# Altium schematic sheet SPTSquidBoard.SchDoc
size A; DocumentNumber: 1; SheetNumber: 1; SheetTotal: 2
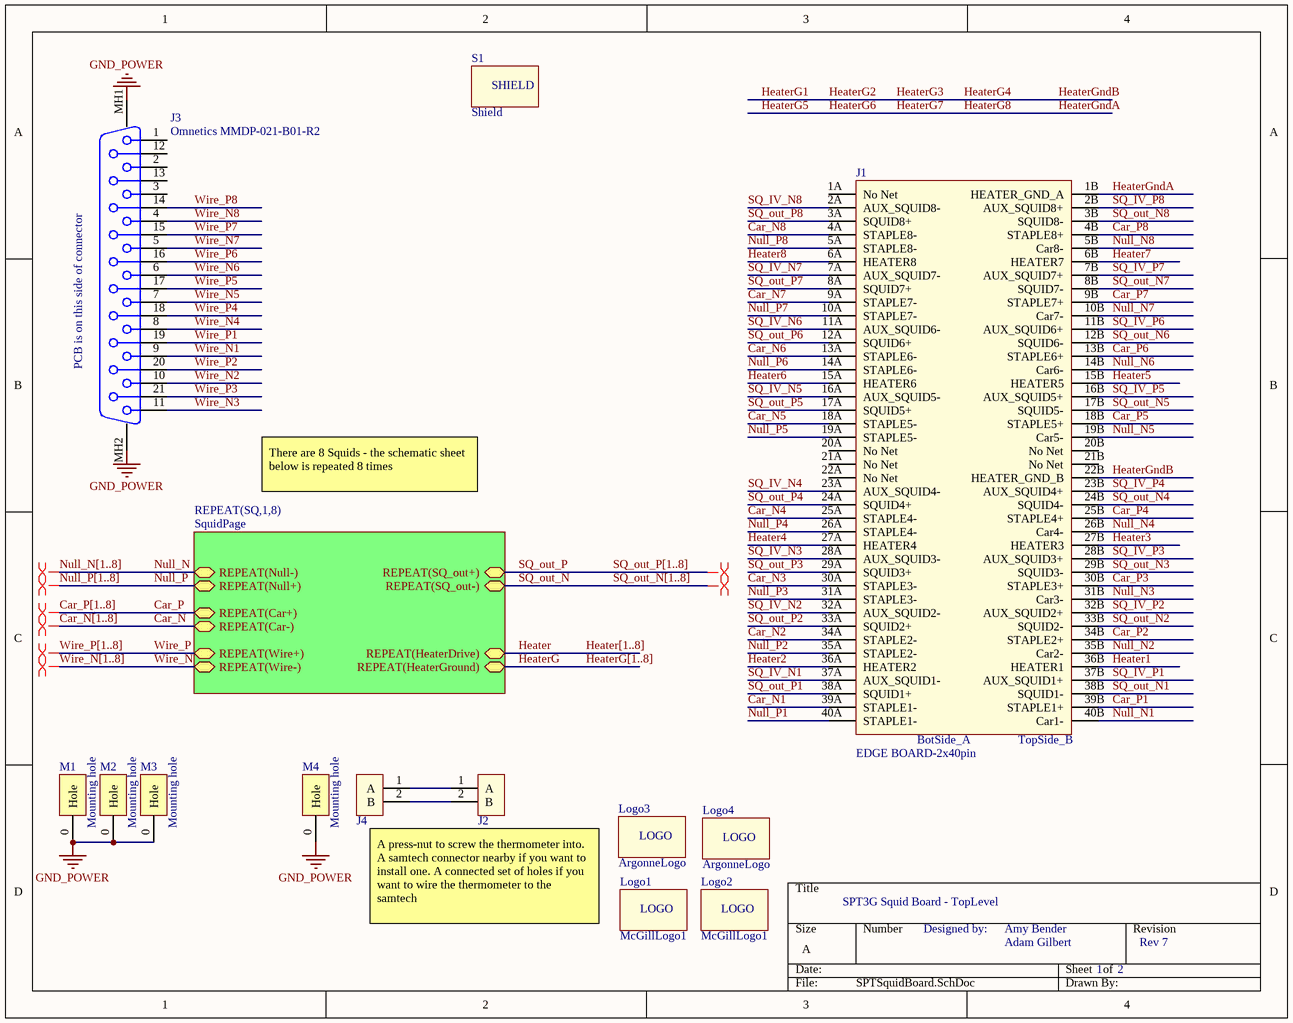
[diagram p0: SPTSquidBoard.SchDoc]

## Parts
J1  EDGE BOARD-2x40pin  (no BOM)
J2  TempSenseWireConnection  [TempSenseWireCons]  (value not drawn)  (no BOM)
J3  Omnetics MMDP-021-B01-R2  [MMDP-021-B02-R2]
J4  TempSenseWireConnection  [TempSenseWireCons]  (value not drawn)  (no BOM)
Logo1  McGillLogo1  [McGillLogo1]  (no BOM)
Logo2  McGillLogo1  [McGillLogo1]  (no BOM)
Logo3  ArgonneLogo  [ArgonneLogo]  (no BOM)
Logo4  ArgonneLogo  [ArgonneLogo]  (no BOM)
M1  Mounting hole  [MountingHoleSquidBoard]  (no BOM)
M2  Mounting hole  [MountingHoleSquidBoard]  (no BOM)
M3  Mounting hole  [MountingHoleSquidBoard]  (no BOM)
M4  Mounting hole  [MountingHoleSquidBoard]  (no BOM)
S1  Shield  [Shield]  (no BOM)

## Sub-sheets
REPEAT(SQ,1,8) = SquidPage: REPEAT(HeaterDrive), REPEAT(Null-), REPEAT(HeaterGround), REPEAT(Car+), REPEAT(Car-), REPEAT(SQ_out+), REPEAT(SQ_out-), REPEAT(Null+), REPEAT(Wire+), REPEAT(Wire-)

## Nets
GND_POWER: J3.MH1 J3.MH2 M1.0(Hole) M2.0(Hole) M3.0(Hole) M4.0(Hole)
Car_N: sheet REPEAT(SQ,1,8)/REPEAT(Car-)
Car_N1: J1.39A(STAPLE1-)
Car_N2: J1.34A(STAPLE2-)
Car_N3: J1.30A(STAPLE3-)
Car_N4: J1.25A(STAPLE4-)
Car_N5: J1.18A(STAPLE5-)
Car_N6: J1.13A(STAPLE6-)
Car_N7: J1.9A(STAPLE7-)
Car_N8: J1.4A(STAPLE8-)
Car_P: sheet REPEAT(SQ,1,8)/REPEAT(Car+)
Car_P1: J1.39B(STAPLE1+)
Car_P2: J1.34B(STAPLE2+)
Car_P3: J1.30B(STAPLE3+)
Car_P4: J1.25B(STAPLE4+)
Car_P5: J1.18B(STAPLE5+)
Car_P6: J1.13B(STAPLE6+)
Car_P7: J1.9B(STAPLE7+)
Car_P8: J1.4B(STAPLE8+)
Heater: sheet REPEAT(SQ,1,8)/REPEAT(HeaterDrive)
Heater1: J1.36B(HEATER1)
Heater2: J1.36A(HEATER2)
Heater3: J1.27B(HEATER3)
Heater4: J1.27A(HEATER4)
Heater5: J1.15B(HEATER5)
Heater6: J1.15A(HEATER6)
Heater7: J1.6B(HEATER7)
Heater8: J1.6A(HEATER8)
HeaterG: sheet REPEAT(SQ,1,8)/REPEAT(HeaterGround)
HeaterG1: J1.22B(HEATER_GND_B)  [also labelled HeaterG2, HeaterG3, HeaterG4, HeaterGndB]
HeaterG5: J1.1B(HEATER_GND_A)  [also labelled HeaterG6, HeaterG7, HeaterG8, HeaterGndA]
Null_N: sheet REPEAT(SQ,1,8)/REPEAT(Null-)
Null_N1: J1.40B(Car1-)
Null_N2: J1.35B(Car2-)
Null_N3: J1.31B(Car3-)
Null_N4: J1.26B(Car4-)
Null_N5: J1.19B(Car5-)
Null_N6: J1.14B(Car6-)
Null_N7: J1.10B(Car7-)
Null_N8: J1.5B(Car8-)
Null_P: sheet REPEAT(SQ,1,8)/REPEAT(Null+)
Null_P1: J1.40A(STAPLE1-)
Null_P2: J1.35A(STAPLE2-)
Null_P3: J1.31A(STAPLE3-)
Null_P4: J1.26A(STAPLE4-)
Null_P5: J1.19A(STAPLE5-)
Null_P6: J1.14A(STAPLE6-)
Null_P7: J1.10A(STAPLE7-)
Null_P8: J1.5A(STAPLE8-)
SQ_IV_N1: J1.37A(AUX_SQUID1-)
SQ_IV_N2: J1.32A(AUX_SQUID2-)
SQ_IV_N3: J1.28A(AUX_SQUID3-)
SQ_IV_N4: J1.23A(AUX_SQUID4-)
SQ_IV_N5: J1.16A(AUX_SQUID5-)
SQ_IV_N6: J1.11A(AUX_SQUID6-)
SQ_IV_N7: J1.7A(AUX_SQUID7-)
SQ_IV_N8: J1.2A(AUX_SQUID8-)
SQ_IV_P1: J1.37B(AUX_SQUID1+)
SQ_IV_P2: J1.32B(AUX_SQUID2+)
SQ_IV_P3: J1.28B(AUX_SQUID3+)
SQ_IV_P4: J1.23B(AUX_SQUID4+)
SQ_IV_P5: J1.16B(AUX_SQUID5+)
SQ_IV_P6: J1.11B(AUX_SQUID6+)
SQ_IV_P7: J1.7B(AUX_SQUID7+)
SQ_IV_P8: J1.2B(AUX_SQUID8+)
SQ_out_N: sheet REPEAT(SQ,1,8)/REPEAT(SQ_out-)
SQ_out_N1: J1.38B(SQUID1-)
SQ_out_N2: J1.33B(SQUID2-)
SQ_out_N3: J1.29B(SQUID3-)
SQ_out_N4: J1.24B(SQUID4-)
SQ_out_N5: J1.17B(SQUID5-)
SQ_out_N6: J1.12B(SQUID6-)
SQ_out_N7: J1.8B(SQUID7-)
SQ_out_N8: J1.3B(SQUID8-)
SQ_out_P: sheet REPEAT(SQ,1,8)/REPEAT(SQ_out+)
SQ_out_P1: J1.38A(SQUID1+)
SQ_out_P2: J1.33A(SQUID2+)
SQ_out_P3: J1.29A(SQUID3+)
SQ_out_P4: J1.24A(SQUID4+)
SQ_out_P5: J1.17A(SQUID5+)
SQ_out_P6: J1.12A(SQUID6+)
SQ_out_P7: J1.8A(SQUID7+)
SQ_out_P8: J1.3A(SQUID8+)
Wire_N: sheet REPEAT(SQ,1,8)/REPEAT(Wire-)
Wire_N1: J3.9
Wire_N2: J3.10
Wire_N3: J3.11
Wire_N4: J3.8
Wire_N5: J3.7
Wire_N6: J3.6
Wire_N7: J3.5
Wire_N8: J3.4
Wire_P: sheet REPEAT(SQ,1,8)/REPEAT(Wire+)
Wire_P1: J3.19
Wire_P2: J3.20
Wire_P3: J3.21
Wire_P4: J3.18
Wire_P5: J3.17
Wire_P6: J3.16
Wire_P7: J3.15
Wire_P8: J3.14
NetJ2_1: J2.1(A) J4.1(A)
NetJ2_2: J2.2(B) J4.2(B)

Not connected (* = marked no-connect by the designer): J1 1A(No_Net) 20A(No_Net) 20B(No_Net) 21A(No_Net) 21B(No_Net) 22A(No_Net); J3 1 2 3 12 13

## Buses and harness runs
bus Car_N[1..8]
bus Car_P[1..8]
bus Heater[1..8]
bus HeaterG[1..8]
bus Null_N[1..8]
bus Null_P[1..8]
bus SQ_out_N[1..8]
bus SQ_out_P[1..8]
bus Wire_N[1..8]
bus Wire_P[1..8]

## Layout directives
differential pair: (no net found under the mark)

## Notes on the sheet
- (near J3) PCB is on this side of connector
- There are 8 Squids - the schematic sheet below is repeated 8 times
- SPT3G Squid Board - TopLevel
- A press-nut to screw the thermometer into.
  A samtech connector nearby if you want to install one. A connected set of holes if you want to wire the thermometer to the samtech
- Designed by:
- Adam Gilbert
- Amy Bender
- 1     2
- Rev 7
- (in symbol EDGE BOARD-2x40pin) BotSide_A; TopSide_B
- (in symbol Logo) LOGO
- (in symbol Shield) SHIELD

## Library data of the parts
J1 = EDGE BOARD-2x40pin: Edge connector
J2 J4 = TempSenseCon
J3 = OmneticsMicroD21
Logo1-Logo4 = Logo
M1-M4 = SquidBoardMountingHole